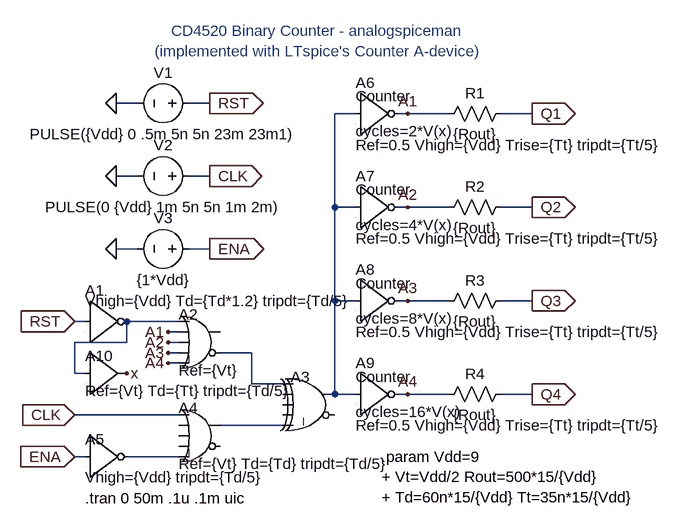
[diagram p0: schematic CD4520-Counter.asc]
CD4520-Counter.asc, the LTspice schematic file:
Version 4
SHEET 1 880 980
WIRE -48 -288 -80 -288
WIRE 64 -288 32 -288
WIRE 288 -272 256 -272
WIRE 368 -272 352 -272
WIRE 432 -272 368 -272
WIRE 560 -272 512 -272
WIRE -48 -176 -80 -176
WIRE 64 -176 32 -176
WIRE 256 -128 256 -272
WIRE 288 -128 256 -128
WIRE 368 -128 352 -128
WIRE 432 -128 368 -128
WIRE 560 -128 512 -128
WIRE -48 -64 -80 -64
WIRE 64 -64 32 -64
WIRE 256 16 256 -128
WIRE 288 16 256 16
WIRE 368 16 352 16
WIRE 432 16 368 16
WIRE 560 16 512 16
WIRE -128 48 -144 48
WIRE 16 48 -64 48
WIRE 16 64 0 64
WIRE -64 80 -64 48
WIRE -64 80 -144 80
WIRE 16 80 0 80
WIRE 16 96 0 96
WIRE 128 96 80 96
WIRE 16 112 0 112
WIRE -144 128 -144 80
WIRE -128 128 -144 128
WIRE 128 144 128 96
WIRE 176 144 128 144
WIRE 256 160 256 16
WIRE 256 160 240 160
WIRE 288 160 256 160
WIRE 368 160 352 160
WIRE 432 160 368 160
WIRE 560 160 512 160
WIRE 16 192 -144 192
WIRE 176 208 80 208
WIRE -128 256 -144 256
WIRE 16 256 -64 256
FLAG 560 -272 Q1
IOPIN 560 -272 Out
FLAG 560 -128 Q2
IOPIN 560 -128 Out
FLAG 560 16 Q3
IOPIN 560 16 Out
FLAG 560 160 Q4
IOPIN 560 160 Out
FLAG -144 192 CLK
IOPIN -144 192 In
FLAG -144 256 ENA
IOPIN -144 256 In
FLAG -144 48 RST
IOPIN -144 48 In
FLAG 64 -176 CLK
IOPIN 64 -176 Out
FLAG 64 -64 ENA
IOPIN 64 -64 Out
FLAG 64 -288 RST
IOPIN 64 -288 Out
FLAG -80 -64 0
FLAG -80 -288 0
FLAG -80 -176 0
FLAG -64 128 x
FLAG 0 64 A1
FLAG 0 80 A2
FLAG 0 96 A3
FLAG 0 112 A4
FLAG 368 -272 A1
FLAG 368 -128 A2
FLAG 368 16 A3
FLAG 368 160 A4
SYMBOL voltage 48 -288 M270
WINDOW 0 32 56 VTop 0
WINDOW 3 -32 56 VBottom 0
WINDOW 123 0 0 Left 0
WINDOW 39 0 0 Left 0
SYMATTR InstName V1
SYMATTR Value PULSE({Vdd} 0 .5m 5n 5n 23m 23m1)
SYMBOL voltage 48 -176 M270
WINDOW 0 32 56 VTop 0
WINDOW 3 -32 56 VBottom 0
SYMATTR InstName V2
SYMATTR Value PULSE(0 {Vdd} 1m 5n 5n 1m 2m)
SYMBOL voltage 48 -64 M270
WINDOW 0 32 56 VTop 0
WINDOW 3 -32 56 VBottom 0
WINDOW 123 0 0 Left 0
WINDOW 39 0 0 Left 0
SYMATTR InstName V3
SYMATTR Value {1*Vdd}
SYMBOL Digital\\inv -128 -16 R0
WINDOW 0 0 16 Left 0
WINDOW 3 0 32 Left 0
SYMATTR InstName A1
SYMATTR Value Vhigh={Vdd} Td={Td*1.2} tripdt={Td/5}
SYMBOL Digital\\or 48 16 R0
WINDOW 0 -32 21 Left 0
WINDOW 3 -32 107 Left 0
SYMATTR InstName A2
SYMATTR Value Ref={Vt}
SYMBOL Digital\\xor 224 112 R0
WINDOW 0 -36 21 Left 0
WINDOW 3 -32 38 Left 0
SYMATTR InstName A3
SYMBOL Digital\\or 48 160 R0
WINDOW 0 -32 21 Left 0
WINDOW 3 -32 107 Left 0
SYMATTR InstName A4
SYMATTR Value Ref={Vt} Td={Td} tripdt={Td/5}
SYMBOL Digital\\inv -128 192 R0
WINDOW 0 0 37 Left 0
WINDOW 3 0 96 Left 0
SYMATTR InstName A5
SYMATTR Value Vhigh={Vdd} tripdt={Td/5}
SYMBOL Digital\\inv 288 -336 R0
WINDOW 0 0 16 Left 0
WINDOW 38 0 37 Left 0
WINDOW 3 0 91 Left 0
WINDOW 123 0 112 Left 0
SYMATTR InstName A6
SYMATTR SpiceModel Counter
SYMATTR Value cycles=2*V(x)
SYMATTR Value2 Ref=0.5 Vhigh={Vdd} Trise={Tt} tripdt={Tt/5}
SYMBOL Digital\\inv 288 -192 R0
WINDOW 0 0 16 Left 0
WINDOW 38 0 37 Left 0
WINDOW 3 0 91 Left 0
WINDOW 123 0 112 Left 0
SYMATTR InstName A7
SYMATTR SpiceModel Counter
SYMATTR Value cycles=4*V(x)
SYMATTR Value2 Ref=0.5 Vhigh={Vdd} Trise={Tt} tripdt={Tt/5}
SYMBOL Digital\\inv 288 -48 R0
WINDOW 0 0 16 Left 0
WINDOW 38 0 37 Left 0
WINDOW 3 0 91 Left 0
WINDOW 123 0 112 Left 0
SYMATTR InstName A8
SYMATTR SpiceModel Counter
SYMATTR Value cycles=8*V(x)
SYMATTR Value2 Ref=0.5 Vhigh={Vdd} Trise={Tt} tripdt={Tt/5}
SYMBOL Digital\\inv 288 96 R0
WINDOW 0 0 16 Left 0
WINDOW 38 0 37 Left 0
WINDOW 3 0 91 Left 0
WINDOW 123 0 112 Left 0
SYMATTR InstName A9
SYMATTR SpiceModel Counter
SYMATTR Value cycles=16*V(x)
SYMATTR Value2 Ref=0.5 Vhigh={Vdd} Trise={Tt} tripdt={Tt/5}
SYMBOL res 528 -288 R90
WINDOW 0 0 56 VBottom 0
WINDOW 3 32 56 VTop 0
SYMATTR InstName R1
SYMATTR Value {Rout}
SYMBOL res 528 -144 R90
WINDOW 0 0 56 VBottom 0
WINDOW 3 32 56 VTop 0
SYMATTR InstName R2
SYMATTR Value {Rout}
SYMBOL res 528 0 R90
WINDOW 0 0 56 VBottom 0
WINDOW 3 32 56 VTop 0
SYMATTR InstName R3
SYMATTR Value {Rout}
SYMBOL res 528 144 R90
WINDOW 0 0 56 VBottom 0
WINDOW 3 32 56 VTop 0
SYMATTR InstName R4
SYMATTR Value {Rout}
SYMBOL Digital\\buf1 -128 64 R0
WINDOW 0 0 37 Left 0
WINDOW 3 0 91 Left 0
SYMATTR InstName A10
SYMATTR Value Ref={Vt} Td={Tt} tripdt={Td/5}
TEXT -128 320 Left 0 !.tran 0 50m .1u .1m uic
TEXT 328 256 Left 0 !.param Vdd=9\n+ Vt=Vdd/2 Rout=500*15/{Vdd}\n+ Td=60n*15/{Vdd} Tt=35n*15/{Vdd}
TEXT 232 -384 Center 0 ;CD4520 Binary Counter - analogspiceman\n(implemented with LTspice's Counter A-device)

The netlist it stands for:
* CD4520-Counter.asc
V1 RST 0 PULSE({Vdd} 0 .5m 5n 5n 23m 23m1)
V2 CLK 0 PULSE(0 {Vdd} 1m 5n 5n 1m 2m)
V3 ENA 0 {1*Vdd}
A1 RST 0 0 0 0 N002 0 0 BUF Vhigh={Vdd} Td={Td*1.2} tripdt={Td/5}
A2 N002 A1 A2 A3 A4 N003 0 0 OR Ref={Vt}
A3 N003 0 0 0 N004 0 N001 0 XOR
A4 CLK 0 0 0 N005 0 N004 0 OR Ref={Vt} Td={Td} tripdt={Td/5}
A5 ENA 0 0 0 0 N005 0 0 BUF Vhigh={Vdd} tripdt={Td/5}
A6 N001 0 0 0 0 A1 0 0 Counter cycles=2*V(x) Ref=0.5 Vhigh={Vdd} Trise={Tt} tripdt={Tt/5}
A7 N001 0 0 0 0 A2 0 0 Counter cycles=4*V(x) Ref=0.5 Vhigh={Vdd} Trise={Tt} tripdt={Tt/5}
A8 N001 0 0 0 0 A3 0 0 Counter cycles=8*V(x) Ref=0.5 Vhigh={Vdd} Trise={Tt} tripdt={Tt/5}
A9 N001 0 0 0 0 A4 0 0 Counter cycles=16*V(x) Ref=0.5 Vhigh={Vdd} Trise={Tt} tripdt={Tt/5}
R1 Q1 A1 {Rout}
R2 Q2 A2 {Rout}
R3 Q3 A3 {Rout}
R4 Q4 A4 {Rout}
A10 N002 0 0 0 0 0 x 0 BUF Ref={Vt} Td={Tt} tripdt={Td/5}
.tran 0 50m .1u .1m uic
.param Vdd=9
+ Vt=Vdd/2 Rout=500*15/{Vdd}
+ Td=60n*15/{Vdd} Tt=35n*15/{Vdd}
* CD4520 Binary Counter - analogspiceman
* (implemented with LTspice's Counter A-device)
.backanno
.end